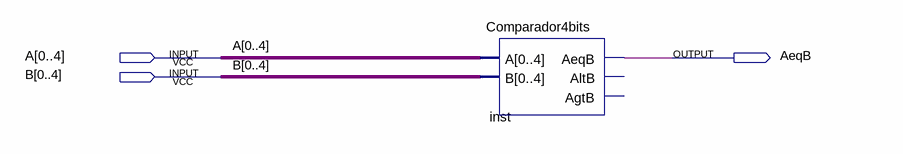
[diagram p0: schematic sheet]
// Quartus schematic Comparador4bitsSinalAeqB.bdf as structural Verilog: 1 symbols, 3 pins
module Comparador4bitsSinalAeqB (
  input  [0:4] A,
  input  [0:4] B,
  output AeqB
);

  Comparador4bits inst (.A(A), .B(B), .AeqB(AeqB));  // open: AltB, AgtB
endmodule
